# EAGLE design Driver (EAGLE 9.6.2)
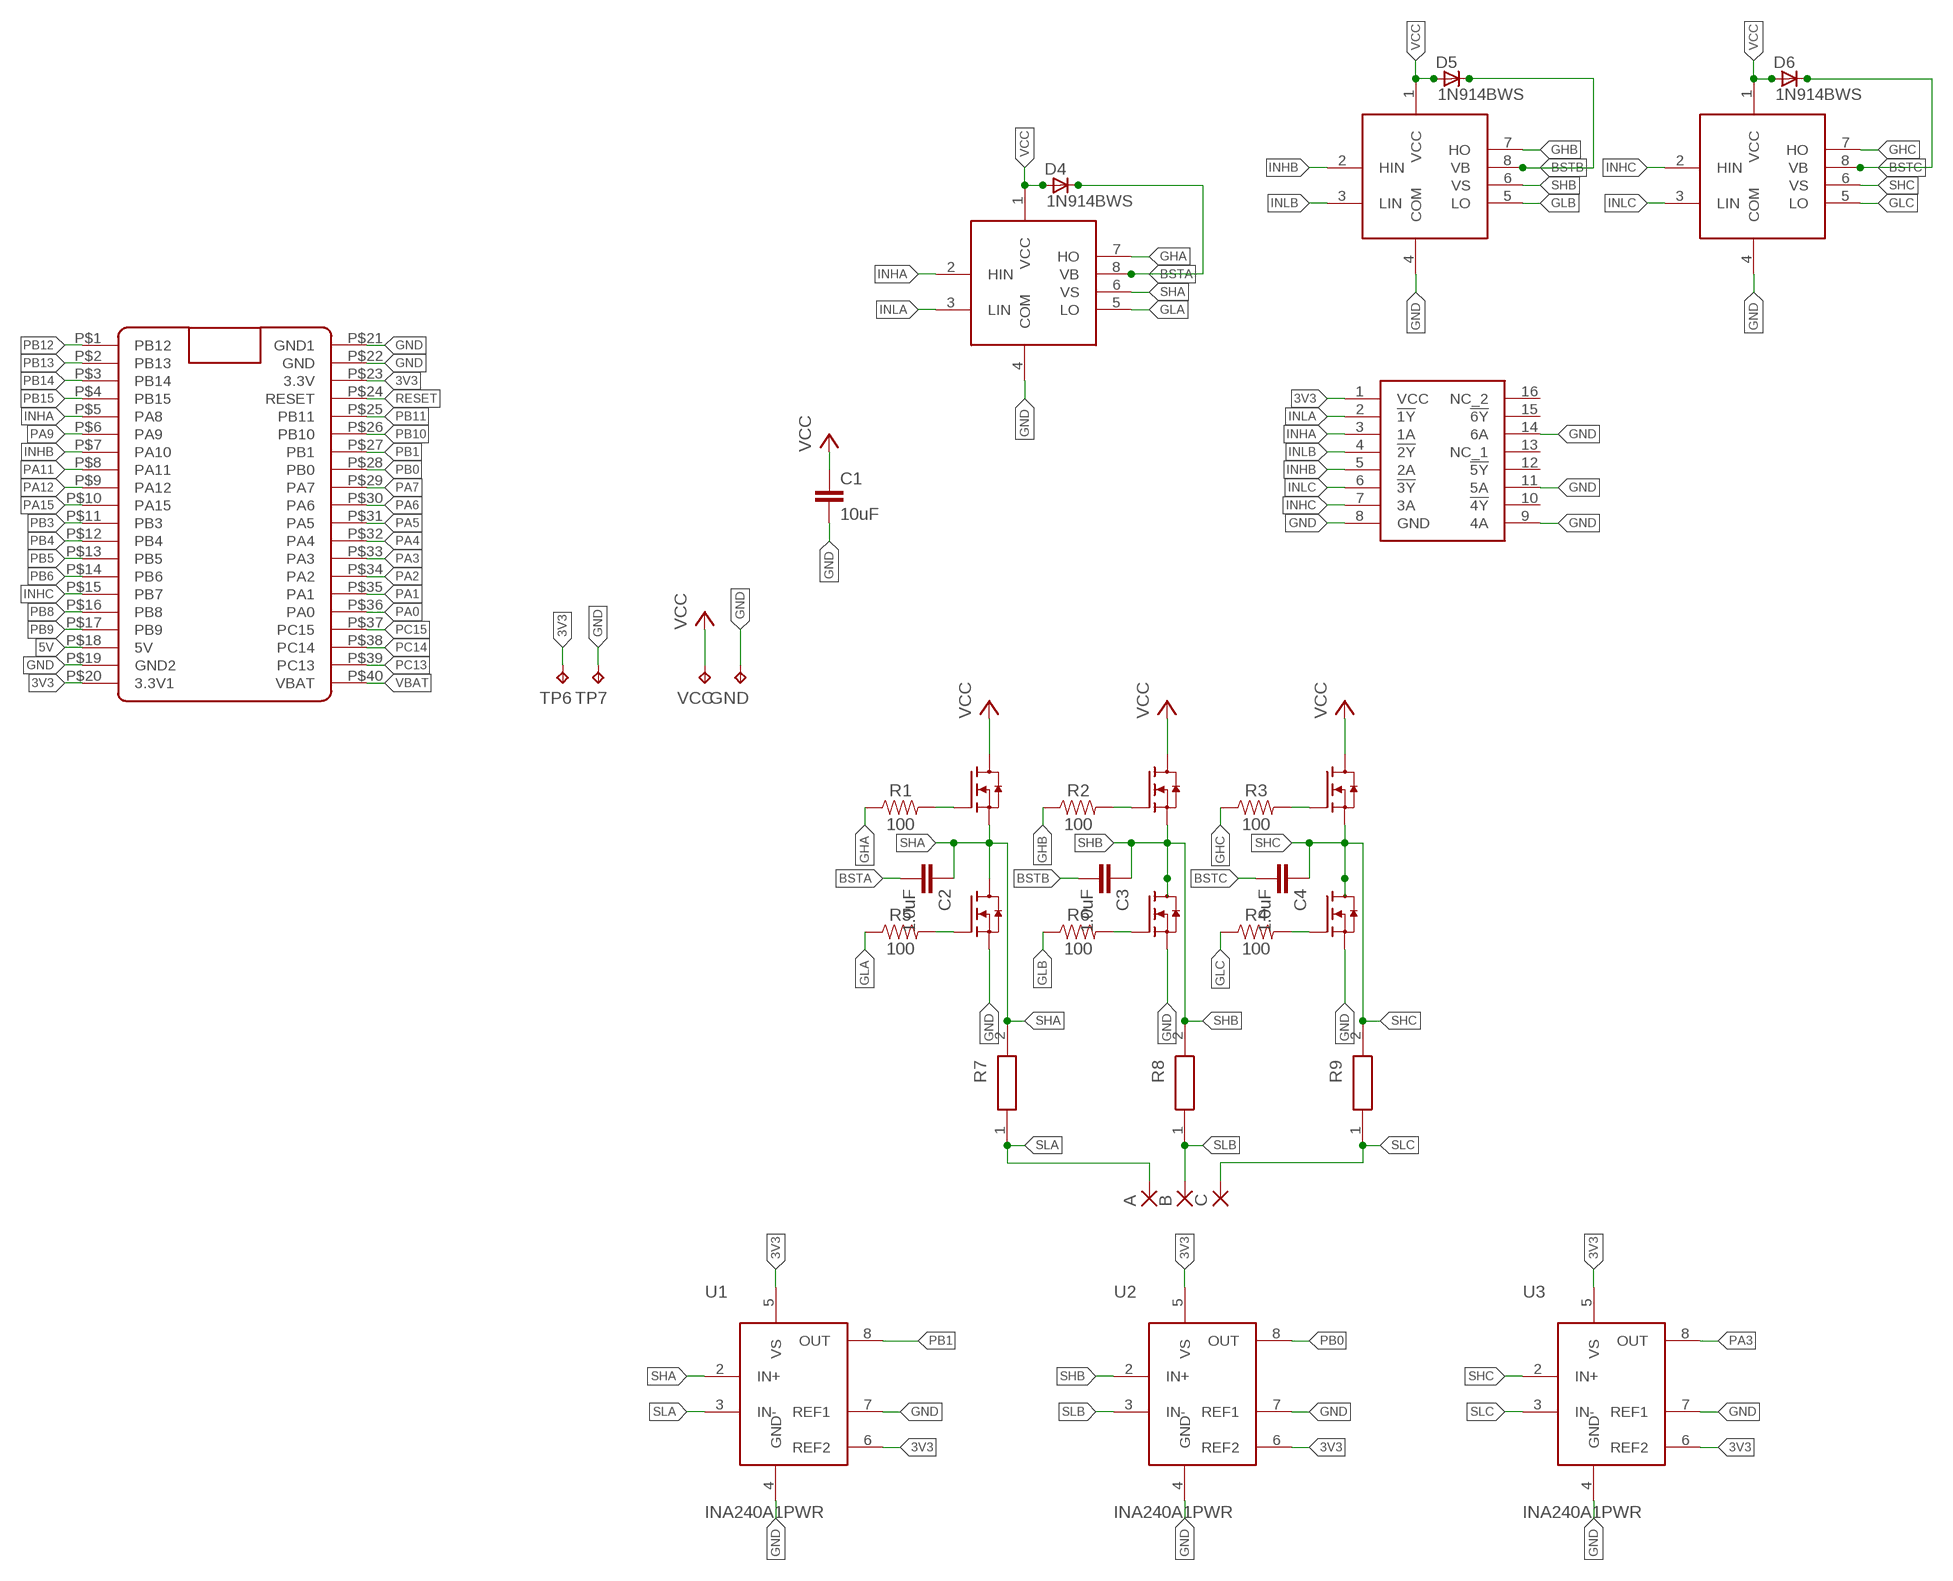
[diagram p0: schematic, sheet 1]

## Parts
A  SMD5  [SMD2,54-5,08]
B  SMD5  [SMD2,54-5,08]
C  SMD5  [SMD2,54-5,08]
C1  10uF  10UF-0603-6.3V-20%  [0603]
C2  1.0uF  1.0UF-0603-16V-10%  [0603]
C3  1.0uF  1.0UF-0603-16V-10%  [0603]
C4  1.0uF  1.0UF-0603-16V-10%  [0603]
D4  1N914BWS  [SOD323F]
D5  1N914BWS  [SOD323F]
D6  1N914BWS  [SOD323F]
GND  TPPAD1-13Y  [P1-13Y]
H-A  IRLR7843  [TO252]
H-B  IRLR7843  [TO252]
H-C  IRLR7843  [TO252]
IC2  CD74HC4049PWR  [SOP65P640X120-16N]
L-A  IRLR7843  [TO252]
L-B  IRLR7843  [TO252]
L-C  IRLR7843  [TO252]
R1  100  100OHM-0603-1/10W-1%  [0603]
R2  100  100OHM-0603-1/10W-1%  [0603]
R3  100  100OHM-0603-1/10W-1%  [0603]
R4  100  100OHM-0603-1/10W-1%  [0603]
R5  100  100OHM-0603-1/10W-1%  [0603]
R6  100  100OHM-0603-1/10W-1%  [0603]
R7  CR2512-FX-51R1ELF  [RESC6331X75N]
R8  CR2512-FX-51R1ELF  [RESC6331X75N]
R9  CR2512-FX-51R1ELF  [RESC6331X75N]
TP6  TPPAD1-13Y  [P1-13Y]
TP7  TPPAD1-13Y  [P1-13Y]
U1  INA240A1PWR  [SOP65P640X120-8N]
U2  INA240A1PWR  [SOP65P640X120-8N]
U3  INA240A1PWR  [SOP65P640X120-8N]
U4  SOIC127P610X320-8NSOIC8  [SOIC127P599X175-8N]
U5  SOIC127P610X320-8NSOIC8  [SOIC127P599X175-8N]
U6  SOIC127P610X320-8NSOIC8  [SOIC127P599X175-8N]
U$1  BLUE_PILL  [BLUE_PILL]
VCC  TPPAD1-13Y  [P1-13Y]

## Nets
3V3: IC2.1(VCC) TP6.TP U1.5(VS) U1.6(REF2) U2.5(VS) U2.6(REF2) U3.5(VS) U3.6(REF2) U$1.P$20(3.3V1) U$1.P$23(3.3V)
5V: U$1.P$18(5V)
BSTA: C2.2 D4.C U4.8(VB)
BSTB: C3.2 D5.C U5.8(VB)
BSTC: C4.2 D6.C U6.8(VB)
GHA: R1.1 U4.7(HO)
GHB: R2.1 U5.7(HO)
GHC: R3.1 U6.7(HO)
GLA: R5.1 U4.5(LO)
GLB: R6.1 U5.5(LO)
GLC: R4.1 U6.5(LO)
GND: C1.2 GND.TP IC2.8(GND) IC2.9(4A) IC2.11(5A) IC2.14(6A) L-A.2(S) L-B.2(S) L-C.2(S) TP7.TP U1.4(GND) U1.7(REF1) U2.4(GND) U2.7(REF1) U3.4(GND) U3.7(REF1) U4.4(COM) U5.4(COM) U6.4(COM) U$1.P$19(GND2) U$1.P$21(GND1) U$1.P$22(GND)
INHA: IC2.3(1A) U4.2(HIN) U$1.P$5(PA8)
INHB: IC2.5(2A) U5.2(HIN) U$1.P$7(PA10)
INHC: IC2.7(3A) U6.2(HIN) U$1.P$15(PB7)
INLA: IC2.2(!1Y) U4.3(LIN)
INLB: IC2.4(!2Y) U5.3(LIN)
INLC: IC2.6(!3Y) U6.3(LIN)
N$1: H-A.1(G) R1.2
N$2: H-B.1(G) R2.2
N$3: H-C.1(G) R3.2
N$4: L-A.1(G) R5.2
N$5: L-B.1(G) R6.2
N$6: L-C.1(G) R4.2
PA0: U$1.P$36(PA0)
PA1: U$1.P$35(PA1)
PA2: U$1.P$34(PA2)
PA3: U3.8(OUT) U$1.P$33(PA3)
PA4: U$1.P$32(PA4)
PA5: U$1.P$31(PA5)
PA6: U$1.P$30(PA6)
PA7: U$1.P$29(PA7)
PA9: U$1.P$6(PA9)
PA11: U$1.P$8(PA11)
PA12: U$1.P$9(PA12)
PA15: U$1.P$10(PA15)
PB0: U2.8(OUT) U$1.P$28(PB0)
PB1: U1.8(OUT) U$1.P$27(PB1)
PB3: U$1.P$11(PB3)
PB4: U$1.P$12(PB4)
PB5: U$1.P$13(PB5)
PB6: U$1.P$14(PB6)
PB8: U$1.P$16(PB8)
PB9: U$1.P$17(PB9)
PB10: U$1.P$26(PB10)
PB11: U$1.P$25(PB11)
PB12: U$1.P$1(PB12)
PB13: U$1.P$2(PB13)
PB14: U$1.P$3(PB14)
PB15: U$1.P$4(PB15)
PC13: U$1.P$39(PC13)
PC14: U$1.P$38(PC14)
PC15: U$1.P$37(PC15)
RESET: U$1.P$24(RESET)
SHA: C2.1 H-A.2(S) L-A.3(D) R7.2 U1.2(IN+) U4.6(VS)
SHB: C3.1 H-B.2(S) L-B.3(D) R8.2 U2.2(IN+) U5.6(VS)
SHC: C4.1 H-C.2(S) L-C.3(D) R9.2 U3.2(IN+) U6.6(VS)
SLA: A.1(P) R7.1 U1.3(IN-)
SLB: B.1(P) R8.1 U2.3(IN-)
SLC: C.1(P) R9.1 U3.3(IN-)
VBAT: U$1.P$40(VBAT)
VCC: C1.1 D4.A D5.A D6.A H-A.3(D) H-B.3(D) H-C.3(D) U4.1(VCC) U5.1(VCC) U6.1(VCC) VCC.TP
Unconnected: IC2.10(!4Y) IC2.12(!5Y) IC2.13(NC_1) IC2.15(!6Y) IC2.16(NC_2)

## Library data of the parts
A B C = wirepad:SMD5: SMD PAD
C1 = SparkFun-Capacitors:10UF: 10.0µF ceramic capacitors A capacitor is a passive two-terminal electrical component used to store electrical energy temporarily in an electric field.; PROD_ID: CAP-11015
C2-C4 = SparkFun-Capacitors:1.0UF: 1µF ceramic capacitors A capacitor is a passive two-terminal electrical component used to store electrical energy temporarily in an electric field.; PROD_ID: CAP-00868
D4-D6 = _hhn_diodes_smd:1N914BWS: 1N914BWS General Purpose Rectifier SMD-Version of 1N914 Case: MELF-MLL41 = DO 213 AB Author: Dipl.-Ing. FH Rainer Bayer HHN Hochschule Heilbronn, rainer.bayer@hs-heilbronn.de Ingenieurbüro ing-rb, mail@ing-rb.de
GND TP6 TP7 VCC = testpad:TP: Test pad
H-A H-B H-C L-A L-B L-C = BLDC project:IRLR7843
IC2 = CD74HC4049PWR:CD74HC4049PWR: High Speed CMOS Logic Hex Inverting Buffers Source: Datasheet <http://www.ti.com/lit/gpn/cd74hc4049>; ARROW_PART_NUMBER: CD74HC4049PWR; ARROW_PRICE-STOCK: https://www.arrow.com/en/products/cd74hc4049pwr/texas-instruments; DESCRIPTION: High Speed CMOS Logic Hex Inverting Buffers; HEIGHT: 1.2mm; MANUFACTURER_NAME: Texas Instruments; MANUFACTURER_PART_NUMBER: CD74HC4049PWR; MOUSER_PART_NUMBER: 595-CD74HC4049PWR; MOUSER_PRICE-STOCK: https://www.mouser.com/Search/Refine.aspx?Keyword=595-CD74HC4049PWR
R1-R6 = SparkFun-Resistors:100OHM: 100Ω resistor A resistor is a passive two-terminal electrical component that implements electrical resistance as a circuit element. Resistors act to reduce current flow, and, at the same time, act to lower voltage levels within circuits. - Wikipedia; PROD_ID: RES-07863
R7-R9 = CR2512-FX-51R1ELF:CR2512-FX-51R1ELF: BOURNS - CR2512-FX-51R1ELF - RES 2512 51R1 1% 1W TC100 28X7511 Source: Datasheet <http://componentsearchengine.com/Datasheets/2/CR2512-FX-51R1ELF.pdf>; ARROW_PART_NUMBER: CR2512-FX-51R1ELF; ARROW_PRICE-STOCK: https://www.arrow.com/en/products/cr2512-fx-51r1elf/bourns; DESCRIPTION: BOURNS - CR2512-FX-51R1ELF - RES 2512 51R1 1% 1W TC100 28X7511; HEIGHT: 0.75mm; MANUFACTURER_NAME: Bourns; MANUFACTURER_PART_NUMBER: CR2512-FX-51R1ELF; MOUSER_PART_NUMBER: 652-CR2512FX51R1ELF; MOUSER_PRICE-STOCK: https://www.mouser.com/Search/Refine.aspx?Keyword=652-CR2512FX51R1ELF
U1-U3 = INA240A1PWR:INA240A1PWR: -4 to 80V, bidirectional, ultra-precise current sense amplifier with enhanced PWM rejection 8-TSSOP -40 to 125 Check availability <https://pricing.snapeda.com/parts/INA240A1PWR/Texas%20Instruments/view-part?ref=eda>; AVAILABILITY: In Stock; DESCRIPTION: -4 to 80V, bidirectional, ultra-precise current sense amplifier with enhanced PWM rejection 8-TSSOP -40 to 125; MF: Texas Instruments; MP: INA240A1PWR; PACKAGE: TSSOP-8 Texas Instruments; PRICE: None; PURCHASE-URL: https://pricing.snapeda.com/search/part/INA240A1PWR/?ref=eda
U4-U6 = SOIC127P610X320-8N:SOIC127P610X320-8N
U$1 = BluePill:BLUE_PILL

## Board
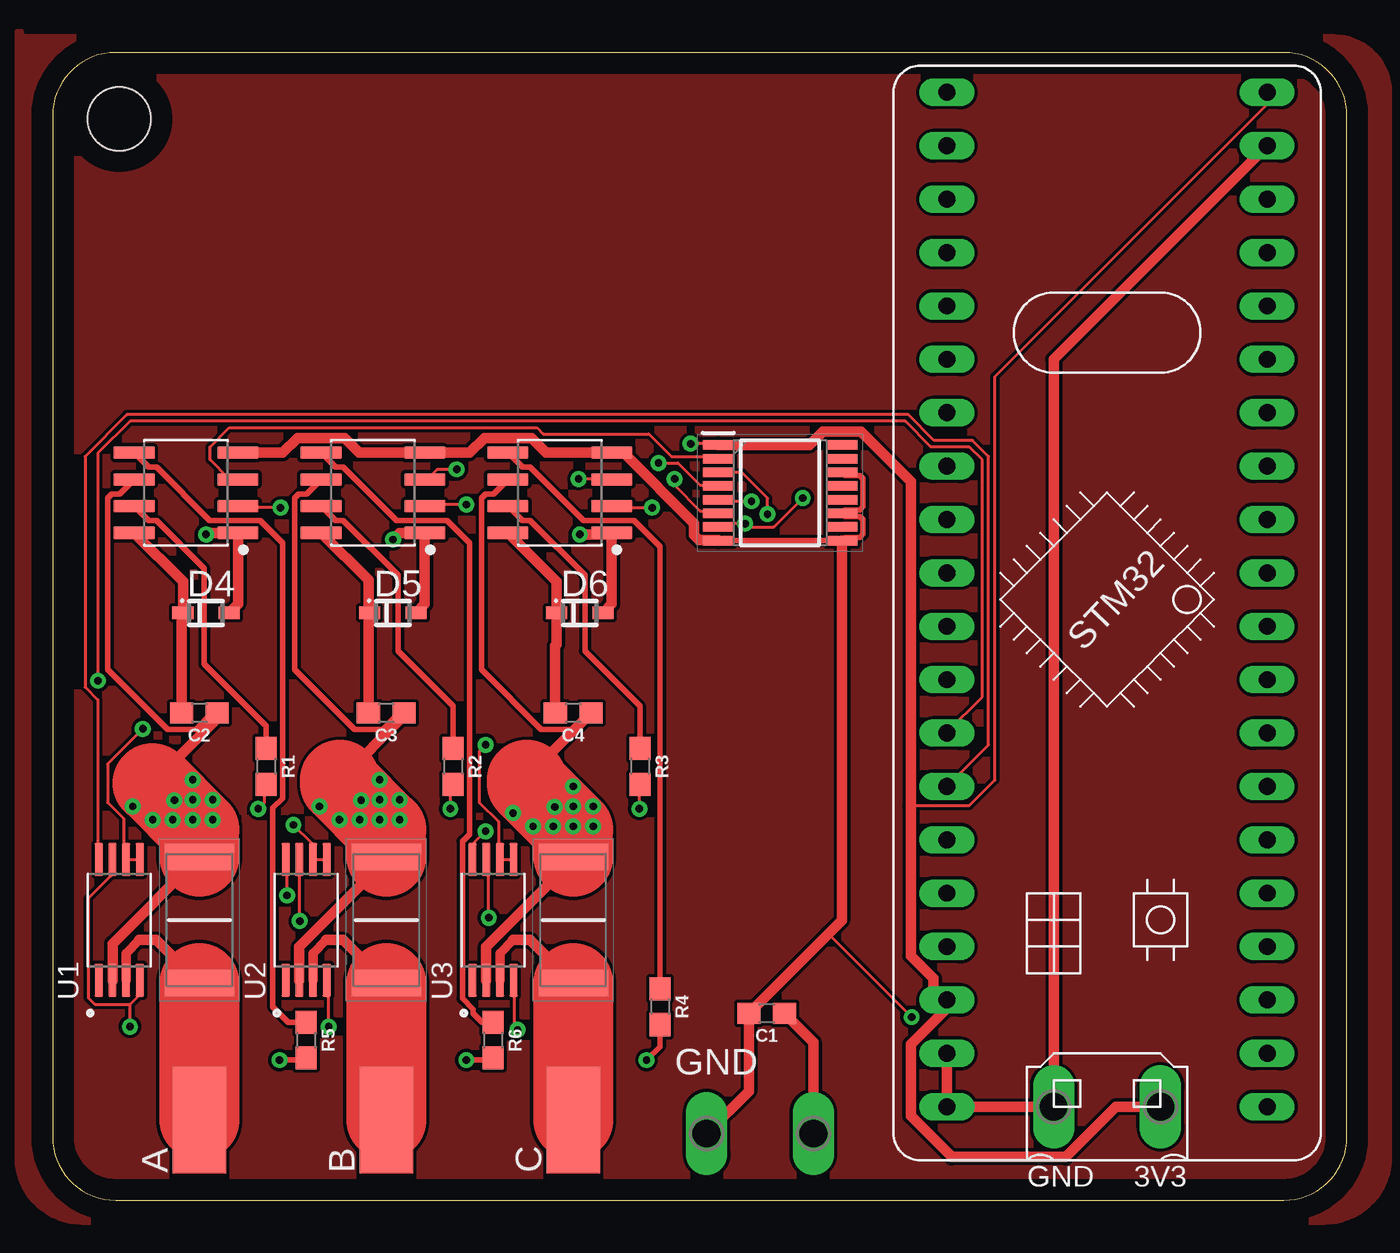
[diagram p1: board, top side]
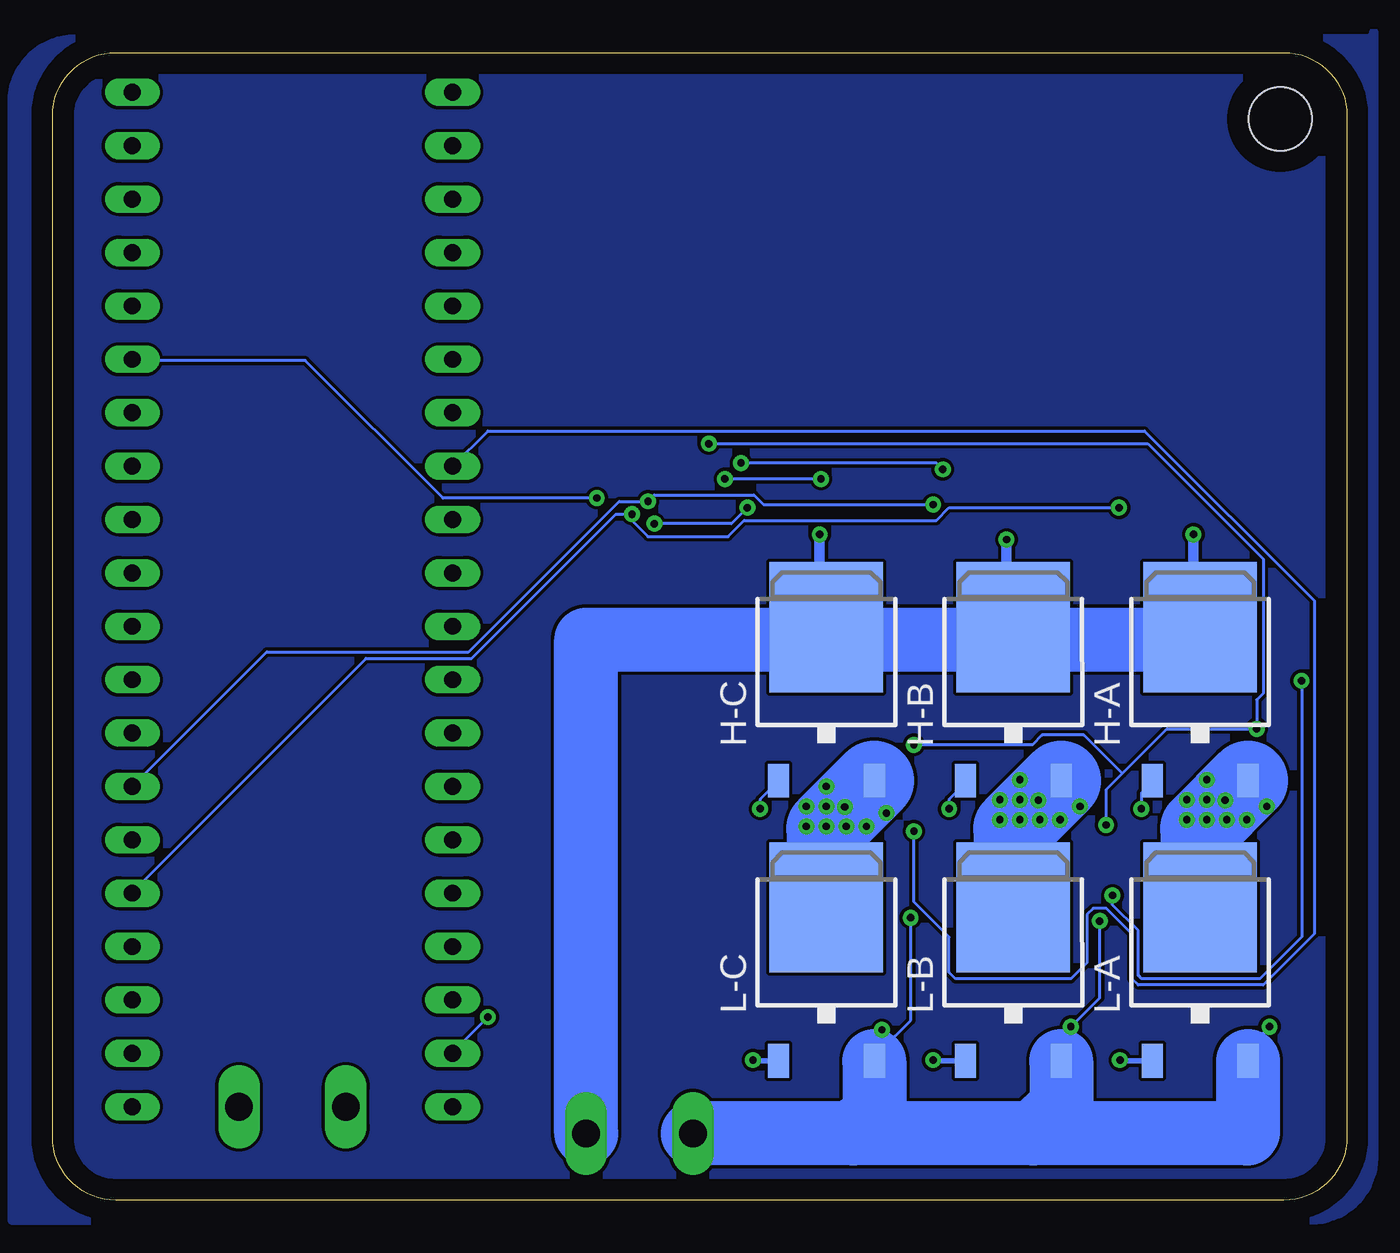
[diagram p2: board, bottom side, seen from below]

Size 61.58 x 54.6 mm. Coordinates in mm from the lower left corner, seen from the top.
Outline: 0,51.6 0,3 arc90 3,0 58.58,0 arc90 61.58,3 61.58,51.6 arc90 58.58,54.6 3,54.6 arc90 0,51.6
Copper layers (1*16): Top 0.035mm / dielectric 1.5mm / Bottom 0.035mm
Design rules "default *": minimum track width 6mil, minimum drill 0.35mm, track to track 6mil, track to pad 6mil, pad to pad 6mil, via to via 6mil, smd to smd 6mil, copper to edge 40mil, drill to drill 6mil, minimum pad ring 10mil, minimum via ring 8mil, stop-mask expansion 4mil, vias tented up to drill 3mm, thermal gap 10mil
Holes 3 mm at 3.17,51.43

### Footprints (pad centres in the part's own frame; a part is rotated, then mirrored left to right if it is on the bottom)
SMD2,54-5,08 = smd 2.54 x 5.08: 1 0,0
0603 = smd 1.1 x 1: 1 -0.85,0; 2 0.85,0
SOD323F = smd 1 x 0.6: A 1.1,0; C -1.1,0
P1-13Y = drill 1.321 pad 1.905 long: TP 0,0
TO252 = smd 1 x 1.6: 1 -2.28,-4.8; 2 2.28,-4.8 | smd 5.4 x 6.2: 3 0,2.5
SOP65P640X120-16N = smd 1.475 x 0.45: 1 -2.938,2.275; 2 -2.938,1.625; 3 -2.938,0.975; 4 -2.938,0.325; 5 -2.938,-0.325; 6 -2.938,-0.975; 7 -2.938,-1.625; 8 -2.938,-2.275; 9 2.938,-2.275; 10 2.938,-1.625; 11 2.938,-0.975; 12 2.938,-0.325; 13 2.938,0.325; 14 2.938,0.975; 15 2.938,1.625; 16 2.938,2.275
RESC6331X75N = smd 1.25 x 3.3: 1 -3,0; 2 3,0
SOP65P640X120-8N = smd 1.57 x 0.41: 1 -2.87,0.975; 2 -2.87,0.325; 3 -2.87,-0.325; 4 -2.87,-0.975; 5 2.87,-0.975; 6 2.87,-0.325; 7 2.87,0.325; 8 2.87,0.975
SOIC127P599X175-8N = smd 1.965 x 0.602: 1 -2.47,1.905; 2 -2.47,0.635; 3 -2.47,-0.635; 4 -2.47,-1.905; 5 2.47,-1.905; 6 2.47,-0.635; 7 2.47,0.635; 8 2.47,1.905
BLUE_PILL = drill 0.8 long: P$1 -7.62,15.24; P$2 -7.62,12.7; P$3 -7.62,10.16; P$4 -7.62,7.62; P$5 -7.62,5.08; P$6 -7.62,2.54; P$7 -7.62,0; P$8 -7.62,-2.54; P$9 -7.62,-5.08; P$10 -7.62,-7.62; P$11 -7.62,-10.16; P$12 -7.62,-12.7; P$13 -7.62,-15.24; P$14 -7.62,-17.78; P$15 -7.62,-20.32; P$16 -7.62,-22.86; P$17 -7.62,-25.4; P$18 -7.62,-27.94; P$19 -7.62,-30.48; P$20 -7.62,-33.02; P$21 7.62,15.24; P$22 7.62,12.7; P$23 7.62,10.16; P$24 7.62,7.62; P$25 7.62,5.08; P$26 7.62,2.54; P$27 7.62,0; P$28 7.62,-2.54; P$29 7.62,-5.08; P$30 7.62,-7.62; P$31 7.62,-10.16; P$32 7.62,-12.7; P$33 7.62,-15.24; P$34 7.62,-17.78; P$35 7.62,-20.32; P$36 7.62,-22.86; P$37 7.62,-25.4; P$38 7.62,-27.94; P$39 7.62,-30.48; P$40 7.62,-33.02

### Placement (x,y rotation side)
A  6.98,3.81 0 top
B  15.88,3.81 0 top
C  24.77,3.81 0 top
C1  33.97,8.89 180 top
C2  6.98,23.18 180 top
C3  15.88,23.18 180 top
C4  24.77,23.18 180 top
D4  7.3,27.94 0 top
D5  16.19,27.94 0 top
D6  25.08,27.94 0 top
GND  31.11,3.17 0 top
H-A  6.98,24.77 0 bottom
H-B  15.88,24.77 0 bottom
H-C  24.77,24.77 0 bottom
IC2  34.61,33.66 0 top
L-A  6.98,11.43 0 bottom
L-B  15.88,11.43 0 bottom
L-C  24.77,11.43 0 bottom
R1  10.16,20.64 270 top
R2  19.05,20.64 270 top
R3  27.94,20.64 270 top
R4  28.89,9.21 270 top
R5  12.06,7.62 270 top
R6  20.95,7.62 270 top
R7  6.98,13.33 90 top
R8  15.88,13.33 90 top
R9  24.77,13.33 90 top
TP6  52.7,4.45 0 top
TP7  47.63,4.45 0 top
U1  3.17,13.33 90 top
U2  12.06,13.33 90 top
U3  20.95,13.33 90 top
U4  6.35,33.66 180 top
U5  15.24,33.66 180 top
U6  24.13,33.66 180 top
U$1  50.17,19.69 180 top
VCC  36.2,3.17 0 top

### Tracks (layer width: path | path; a pad name or v marks a point on that pad's centre or on a via)
3V3  (via drill 0.35)
  Top 0.152: U3.5 21.82,16.18 21.36,16.18 U3.6 21.21,16.33 21.21,18.01 20.3,18.92 20.3,21.36 v20.6,21.67 | U1.5 4.14,16.18 3.53,16.18 U1.6 3.38,16.33 3.38,18.16 2.62,18.92 2.62,20.75 v4.29,22.43 | U2.5 12.98,16.18 12.52,16.18 U2.6 12.37,16.33 12.37,16.94 v11.45,17.86 | U$1.P$20 57.79,52.15 44.83,39.19 44.83,19.99 43.61,18.77 40.83,18.77 | v30.35,35.99 31.42,35.99 IC2.1
  Top 0.508: TP6.TP 50.59,4.45 48.2,2.06 42.78,2.06 40.83,4.01 40.83,7.42 42.55,9.14 U$1.P$23 41.91,9.53 41.91,10.55 40.83,11.63 40.83,18.77 40.83,34.18 38.45,36.56 36.64,36.56 36.01,35.93 IC2.1
  Bottom 0.152: 10.69,20.3 11.45,19.53 v11.45,17.86 | 10.69,20.3 8.56,22.43 v4.29,22.43 4.29,23.8 3.99,24.11 3.99,30.51 9.47,35.99 v30.35,35.99 | v20.6,21.67 14.96,21.67 14.5,22.12 12.52,22.12 10.69,20.3
BOTTOM
  pour Bottom: -1.27,55.56 -1.27,2.05 arc90 1.73,-0.95 63.5,-0.95 63.5,52.24 arc90 60.5,55.24 -0.95,55.24 arc-90
BSTA
  Top 0.508: U4.8 6.2,29.43 D4.C 6.14,27.87 C2.2
BSTB
  Top 0.508: 15.03,27.87 D5.C | C3.2 15.03,27.87 | 15.03,27.87 15.03,29.5 U5.8
BSTC
  Top 0.508: C4.2 23.92,26.37 23.98,26.44 D6.C 23.98,29.43 U6.8
GHA
  Top 0.254: U4.7 4.57,32.33 4.94,32.33 7.22,30.05 7.22,25.5 10.16,22.57 R1.1
GHB
  Top 0.254: U5.7 13.46,32.33 13.83,32.33 16.43,29.73 16.43,26.14 19.05,23.52 R2.1
GHC
  Top 0.254: U6.7 22.35,32.33 22.72,32.33 25.32,29.73 25.32,26.14 27.94,23.52 R3.1
GLA
  Top 0.254: U4.5 4.57,34.87 4.94,34.87 7.48,32.33 9.88,32.33 10.94,31.27 10.94,19.12 10.48,18.66 10.48,9.21 11.22,8.47 R5.1
GLB
  Top 0.254: U5.5 13.46,34.87 13.83,34.87 16.37,32.33 18.77,32.33 19.83,31.27 19.83,17.41 19.5,17.08 19.5,9.59 20,9.09 20,8.89 20.42,8.47 R6.1
GLC
  Top 0.254: U6.5 22.35,34.87 22.72,34.87 25.26,32.33 27.66,32.33 28.89,31.1 R4.1
GND  (via drill 0.35)
  Top 0.152: 3.68,9.32 4.14,9.78 4.14,10.39 U1.4 | 3.68,9.32 2.01,9.32 1.7,9.63 1.7,14.35 2.77,15.42 2.77,16.18 U1.7 | v13.13,8.26 13.13,10.39 U2.4 | v22.12,8.1 21.97,8.26 21.97,10.39 U3.4 | v11.76,13.28 11.76,16.18 U2.7 | v20.75,13.44 20.75,16.18 U3.7 | v3.68,8.26 3.68,9.32 | v40.87,8.71 36.91,12.67
  Top 0.254: IC2.14 37.69,34.48 38.4,34.48 38.56,34.32 38.56,32.99 38.4,32.83 37.69,32.83 IC2.11 37.69,32.53 38.4,32.53 38.56,32.37 38.56,31.69 38.4,31.53 37.69,31.53 IC2.9 IC2.8
  Top 0.508: U$1.P$22 U$1.P$21 TP7.TP 47.63,40 U$1.P$19 | GND.TP 33.12,5.18 C1.2 36.91,12.67 37.55,13.31 IC2.9 | U4.4 10.95,35.56 11.65,36.27 13.89,36.27 14.59,35.56 U5.4 19.84,35.56 20.54,36.27 22.78,36.27 23.48,35.56 U6.4 27.15,35.56 30.53,32.19 30.53,31.64 30.76,31.4 31.65,31.4 IC2.8
  Bottom 0.152: L-B.2 13.28,8.1 v13.13,8.26 11.76,9.63 v11.76,13.28 | v22.12,8.1 L-C.2 21.51,7.8 20.75,8.56 v20.75,13.44 | v3.68,8.26 3.99,7.95 L-A.2 | v40.87,8.71 42.55,7.04 U$1.P$22
  Bottom 3.048: 14.92,3.17 4.76,3.17 4.7,3.23 L-A.2 | 14.92,3.17 23.5,3.17 | 23.5,3.17 GND.TP | L-B.2 13.59,4.5 14.92,3.17 | L-C.2 22.48,4.18 23.5,3.17
INHA  (via drill 0.35)
  Top 0.152: v34.01,32.64 34.01,33.4 32.79,34.62 31.73,34.62 IC2.3 | v10.85,32.94 8.87,32.94 U4.2
  Bottom 0.152: 34.32,32.64 34.77,32.64 41.63,25.78 46.66,25.78 57.79,14.66 U$1.P$5 | v10.85,32.94 18.92,32.94 19.53,32.33 28.68,32.33 29.44,31.57 33.25,31.57 34.32,32.64 | 34.32,32.64 v34.01,32.64
INHB  (via drill 0.35)
  Top 0.152: v33.25,33.25 31.73,33.25 IC2.5 | v19.69,33.1 17.86,33.1 U5.2
  Bottom 0.152: U$1.P$7 51.38,26.09 41.78,26.09 34.62,33.25 v33.25,33.25 32.94,33.55 28.22,33.55 27.76,33.1 v19.69,33.1
INHC  (via drill 0.35)
  Top 0.152: v28.52,32.94 26.7,32.94 U6.2 | IC2.7 31.73,32.18 v32.94,32.18 33.1,32.03 34.32,32.03 v35.69,33.4
  Bottom 0.152: v32.94,32.18 29.29,32.18 v28.52,32.94 | v35.69,33.4 43,33.4 49.55,39.95 57.79,39.95 U$1.P$15
INLA
  Top 0.152: IC2.2 31.57,35.38 29.44,35.38 28.37,36.45 23.34,36.45 23.04,36.75 8.41,36.75 7.49,35.84 7.49,35.23 8.41,34.31 8.71,34.31 U4.3
INLB  (via drill 0.35)
  Top 0.152: v28.83,35.08 29.74,35.08 30.81,34.01 31.57,34.01 IC2.4 | v19.23,34.77 18.31,34.77 17.86,34.31 U5.3
  Bottom 0.152: v28.83,35.08 19.53,35.08 v19.23,34.77
INLC  (via drill 0.35)
  Top 0.152: v29.59,34.31 29.59,34.01 30.81,32.79 31.57,32.79 IC2.6 | v25.02,34.31 26.54,34.31 U6.3
  Bottom 0.152: v25.02,34.31 v29.59,34.31
N$1  (via drill 0.35)
  Top 0.152: v9.78,18.62 10.08,18.92 10.08,19.69 R1.2
  Bottom 0.152: v9.78,18.62 9.78,19.38 9.32,19.84 H-A.1
N$2  (via drill 0.35)
  Top 0.152: v18.92,18.62 18.92,19.69 R2.2
  Bottom 0.152: v18.92,18.62 18.92,19.08 18.16,19.84 H-B.1
N$3  (via drill 0.35)
  Top 0.152: v27.92,18.62 27.92,19.69 R3.2
  Bottom 0.152: v27.92,18.62 27.92,19.08 27.15,19.84 H-C.1
N$4  (via drill 0.35)
  Top 0.254: R5.2 11.96,6.67 v10.8,6.67
  Bottom 0.254: v10.8,6.67 10.76,6.63 L-A.1
N$5  (via drill 0.35)
  Top 0.254: R6.2 20.85,6.67 v19.69,6.67
  Bottom 0.254: v19.69,6.67 19.65,6.63 L-B.1
N$6  (via drill 0.35)
  Top 0.254: R4.2 28.89,7.3 v28.26,6.67
  Bottom 0.254: v28.26,6.67 28.22,6.63 L-C.1
N$7
  pour Top: -1.59,55.56 -1.59,2.05 arc90 1.41,-0.95 3.17,-0.95 60.5,-0.95 arc90 63.5,2.05 63.5,52.7 arc90 60.96,55.24 -1.27,55.24 arc-90
PA3  (via drill 0.35)
  Top 0.152: v20.6,17.55 19.99,16.94 19.99,16.33 U3.8
  Bottom 0.152: v20.6,17.55 20.6,14.2 18.92,12.52 18.92,10.85 18.62,10.54 13.13,10.54 12.37,11.3 12.37,13.59 12.06,13.89 11.45,13.89 10.24,12.67 10.24,10.54 9.93,10.24 3.99,10.24 1.55,12.67 1.55,28.52 9.63,36.6 40.87,36.6 U$1.P$33
PB0  (via drill 0.35)
  Top 0.152: v11.15,14.5 11.15,16.18 U2.8 | v2.16,24.71 2.16,35.53 3.68,37.06 40.56,37.06 41.78,35.84 43.61,35.84 44.22,35.23 44.22,23.95 42.55,22.28 U$1.P$28
  Bottom 0.152: v11.15,14.5 11.15,14.05 9.93,12.83 9.93,10.69 9.78,10.54 4.14,10.54 2.16,12.52 v2.16,24.71
PB1
  Top 0.152: U$1.P$27 44.53,21.67 44.53,35.38 43.76,36.14 41.94,36.14 40.72,37.36 3.53,37.36 1.55,35.38 1.55,24.41 2.16,23.8 2.16,16.33 U1.8
SHA  (via drill 0.35)
  Top 0.254: U4.6 3.19,33.6 2.82,33.6 2.62,33.4 2.62,25.25 5.47,22.4 6.8,22.4 7.58,23.18 C2.1
  Top 0.508: v6.67,20 v6.67,19.05 v7.62,19.05 v7.62,18.1 v6.67,18.1 | v6.67,18.1 4.92,19.84 4.76,19.84 | v5.79,19.03 5.79,18.17 v5.72,18.1 v4.76,18.1 4.45,18.1 v3.81,18.73 3.81,18.89 4.76,19.84 | v6.67,18.1 6.98,17.78 R7.2 2.85,12.2 U1.2 | C2.1 7.84,22.92 4.76,19.84
  Top 3.81: R7.2 6.98,17.62 4.76,19.84
  Bottom 0.152: 6.98,17.69 6.73,18.01 v6.67,18.1
  Bottom 3.81: H-A.2 6.98,17.69 L-A.3
SHB  (via drill 0.35)
  Top 0.254: U5.6 12.08,33.6 11.71,33.6 11.51,33.4 11.51,25.25 14.36,22.4 15.69,22.4 16.35,23.06 16.73,23.06
  Top 0.508: v15.56,20 v15.56,19.05 | v15.56,19.05 15.53,19.03 v14.68,19.03 | v12.7,18.73 13.02,18.73 v13.65,18.1 v14.61,18.1 | v14.61,18.1 v15.56,18.1 | v15.56,18.1 v15.56,19.05 | v14.68,19.03 14.68,18.17 v14.61,18.1 | v16.51,18.1 v16.51,19.05 v15.56,19.05 | v15.56,18.1 15.88,17.78 R8.2 15.88,16.19 11.74,12.06 U2.2 | 13.67,19.83 14.47,19.03 v14.68,19.03 | C3.1 16.73,23.06 13.67,20
  Top 3.81: R8.2 15.88,17.62 13.67,19.83 13.67,20
  Bottom 0.152: 15.88,17.69 15.57,18.01 v15.56,18.1
  Bottom 3.81: H-B.2 15.88,17.69 L-B.3
SHC  (via drill 0.35)
  Top 0.254: U6.6 20.97,33.6 20.6,33.6 20.4,33.4 20.4,25.25 23.25,22.4 24.84,22.4 C4.1
  Top 0.508: v24.77,18.73 v24.77,19.69 23.81,18.73 | v24.77,18.73 24.77,17.62 24.61,17.78 v23.81,17.78 23.89,17.86 | v24.77,18.73 24.74,18.71 v23.89,18.71 23.89,17.86 | v24.77,18.73 v25.72,18.73 v25.72,17.78 v24.77,17.78 R9.2 24.77,16.19 20.63,12.06 U3.2 | 23.81,18.73 23.5,18.42 v21.91,18.42 | v22.86,17.78 22.94,17.86 23.89,17.86 | 22.56,19.83 23.65,18.73 23.81,18.73 | C4.1 22.56,20.12 22.56,20
  Top 3.81: R9.2 24.77,17.62 22.56,19.83 22.56,20
  Bottom 0.152: 24.77,17.69 24.71,17.7 v24.77,17.78
  Bottom 3.81: H-C.2 24.77,17.69 L-C.3
SLA
  Top 0.457: U1.3 3.5,11.75 4.13,12.38
  Top 0.508: 4.13,12.38 4.94,12.38 R7.1
  Top 3.81: R7.1 A.1
SLB
  Top 0.457: U2.3 12.39,11.75 13.02,12.38
  Top 0.508: 13.02,12.38 13.83,12.38 R8.1
  Top 3.81: R8.1 B.1
SLC
  Top 0.457: U3.3 21.28,11.75 21.91,12.38
  Top 0.508: 21.91,12.38 22.72,12.38 R9.1
  Top 3.81: R9.1 C.1
VCC  (via drill 0.35)
  Top 0.508: C1.1 36.2,7.52 VCC.TP | D4.A 8.82,28.36 U4.1 7.38,31.75 v7.3,31.67 | D5.A 17.71,28.36 U5.1 16.51,31.75 v16.19,31.43 | D6.A 26.6,28.36 U6.1 26.52,31.67 v25.08,31.67
  Bottom 0.152: 25.17,28.07 25.08,28.07 | 16.19,28.89 16.33,28.68 H-B.3 15.88,27.31 16.83,26.67 | 7.04,26.67 7.04,27.15 H-A.3 6.88,28.07 6.84,28.11 | 25.17,28.07 H-C.3 | 25.17,28.07 25.17,26.67
  Bottom 0.508: v7.3,31.67 7.3,28.58 6.84,28.11 6.67,27.94 | v16.19,31.43 16.19,28.89 15.88,28.58 | v25.08,31.67 25.08,28.07 25.08,27.62
  Bottom 3.048: VCC.TP 36.2,26.67 25.17,26.67 16.83,26.67 | 15.56,26.67 15.24,26.67 15.24,26.04 15.56,26.04 15.56,26.67 | 15.56,26.67 16.83,26.67 | 16.83,26.67 16.83,26.04 | H-B.3 15.88,26.67 7.04,26.67 6.67,26.67

### Text on the board
tPlace: GND | 3V3